# Altium project datapool_8810.PrjPcb
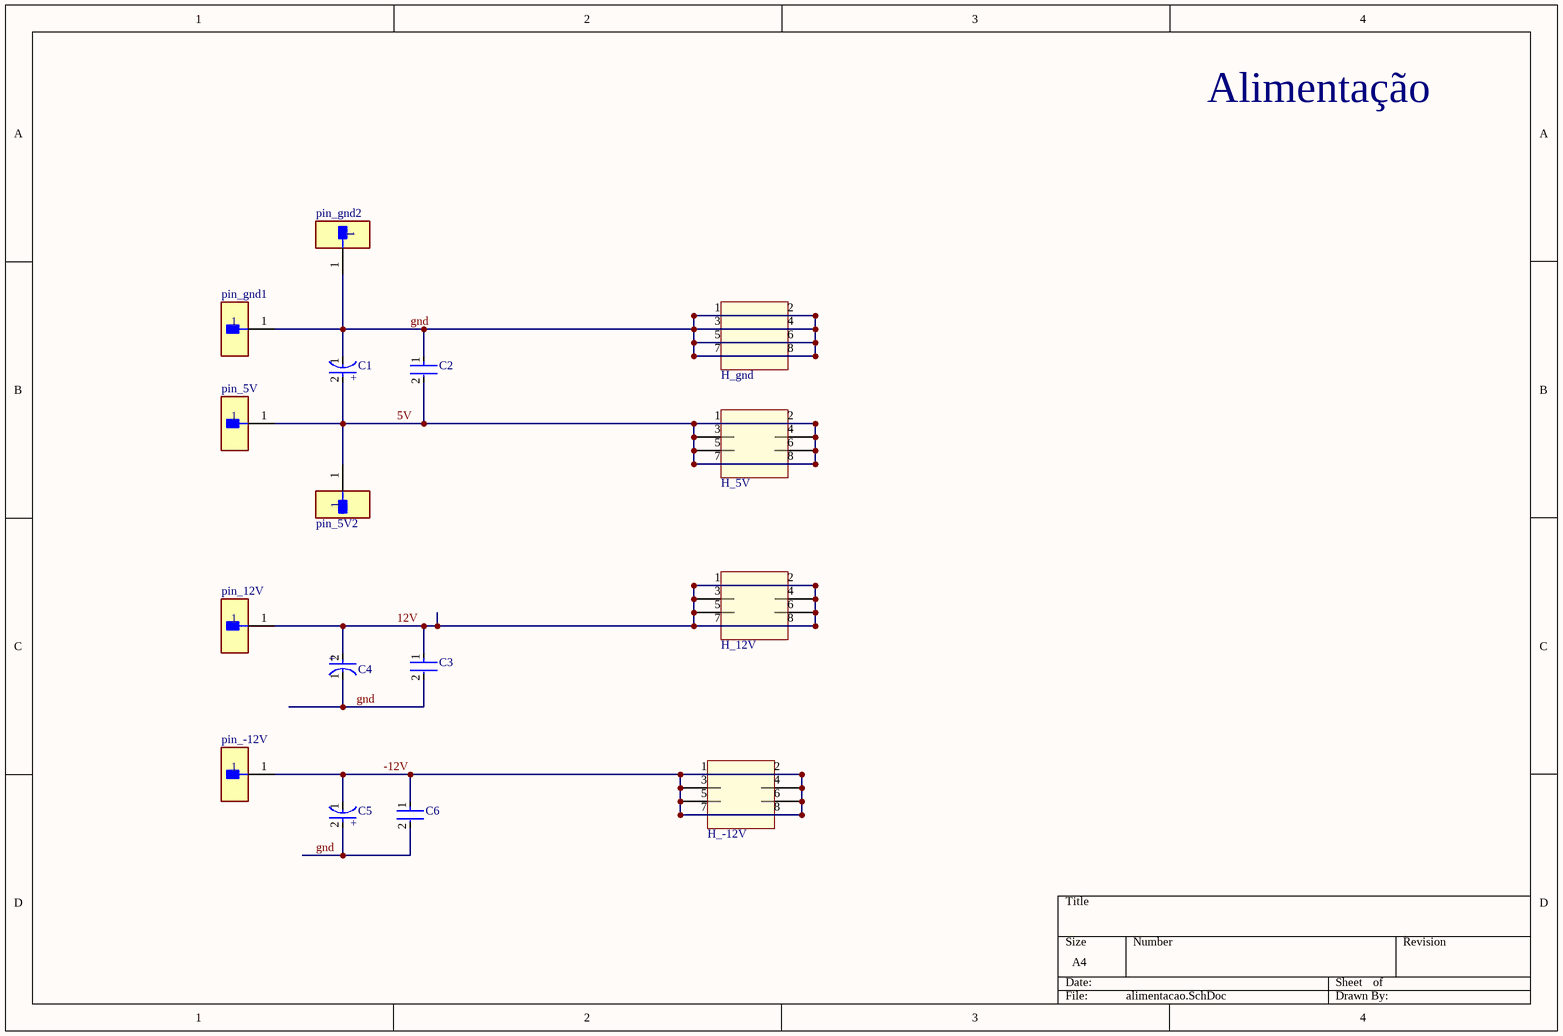
[diagram p0: alimentacao.SchDoc]
4 sheets, 138 parts. Net scope: global (net labels, ports and power ports of the same name join across sheets).
Board file: 8810.PcbDoc
Sheets:
  alimentacao.SchDoc
  leds.SchDoc
  chaves.SchDoc
  clock.SchDoc

## Sheet alimentacao.SchDoc
size A4; SheetNumber: 1; SheetTotal: 7

### Parts
C1  EEU-FM1H101BJ  [FP-FM8-MFG]  (value not drawn)
C2  RCER71H335K3K1H03B  [FP-RCE3M1-MFG]  (value not drawn)
C3  RCER71H335K3K1H03B  [FP-RCE3M1-MFG]  (value not drawn)
C4  EEU-FM1H101BJ  [FP-FM8-MFG]  (value not drawn)
C5  EEU-FM1H101BJ  [FP-FM8-MFG]  (value not drawn)
C6  RCER71H335K3K1H03B  [FP-RCE3M1-MFG]  (value not drawn)
H_5V  header 2x4  [header 2x4]  (value not drawn)
H_12V  header 2x4  [header 2x4]  (value not drawn)
H_-12V  header 2x4  [header 2x4]  (value not drawn)
H_gnd  header 2x4  [header 2x4]  (value not drawn)
pin_5V  TSW-101-07-L-S  [FP-TSW-101-07-L-S-MFG]  (value not drawn)
pin_5V2  TSW-101-07-L-S  [FP-TSW-101-07-L-S-MFG]  (value not drawn)
pin_12V  TSW-101-07-L-S  [FP-TSW-101-07-L-S-MFG]  (value not drawn)
pin_-12V  TSW-101-07-L-S  [FP-TSW-101-07-L-S-MFG]  (value not drawn)
pin_gnd1  TSW-101-07-L-S  [FP-TSW-101-07-L-S-MFG]  (value not drawn)
pin_gnd2  TSW-101-07-L-S  [FP-TSW-101-07-L-S-MFG]  (value not drawn)

### Nets
5V: C1.2(A) C2.2 H_5V.1 H_5V.2 H_5V.3 H_5V.4 H_5V.5 H_5V.6 H_5V.7 H_5V.8 pin_5V.1 pin_5V2.1
12V: C3.1 C4.2(A) H_12V.1 H_12V.2 H_12V.3 H_12V.4 H_12V.5 H_12V.6 H_12V.7 H_12V.8 pin_12V.1
-12V: C5.1(C) C6.1 H_-12V.1 H_-12V.2 H_-12V.3 H_-12V.4 H_-12V.5 H_-12V.6 H_-12V.7 H_-12V.8 pin_-12V.1
gnd: C1.1(C) C2.1 C3.2 C4.1(C) C5.2(A) C6.2 H_gnd.1 H_gnd.2 H_gnd.3 H_gnd.4 H_gnd.5 H_gnd.6 H_gnd.7 H_gnd.8 pin_gnd1.1 pin_gnd2.1

### Notes on the sheet
- Alimentação
- (in symbol CMP-05427-000021-1) +

### Library data of the parts
C1 C4 C5 = CMP-05427-000021-1: CAP ALUM 100UF 20% 50V RADIAL; Polarity: Polar; Impedance: 61mR; Ripple Current: 870mA; Life (Hours): 3000Hour; Dissipation Factor: 0.1%; Packaging: Ammo Pack; Voltage Rating (DC): 50V; Diameter: 8mm; Radiation Hardening: No; Max Operating Temperature: 105°C; Length: 11.5mm; Tolerance: 20%; Termination: Radial; Features: General Purpose; Case/Package: Radial; Voltage Rating: 50V; Min Operating Temperature: -40°C; Height - Seated (Max): 0.512inch; Mount: Through Hole; Series: FM; Height: 11.5mm; Capacitance: 100uF; ESR (Equivalent Series Resistance): 61mR; Lead Free: Lead Free; Lead Pitch: 0.197inch; Package Quantity: 1000
C2 C3 C6 = CMP-06035-028451-1: Cap Ceramic 3.3uF 50V X7R ±10% Radial 5mm +125°C Automotive Ammo Pack; Lead Diameter: 0.5mm; Lead/Base Style: Formed Leads; Height: 5mm; Ratings: AEC-Q200; Capacitance: 3.3uF; Package Quantity: 500; Length: 0.217inch; Min Operating Temperature: -55°C; Voltage Rating (DC): 50V; Dielectric: X7R; Case/Package: Radial; Height - Seated (Max): 0.197inch; Termination: Radial; Mount: Through Hole; Max Operating Temperature: 125°C; Width: 0.157inch; Voltage Rating: 50V; Packaging: Bulk; Resistor Type: Ceramic; Tolerance: 10%; Lead Pitch: 0.197inch
H_5V H_12V H_-12V H_gnd = header 2x4: header male 2x4; pin to pad: 1>C1 2>C2 3>C3 4>C4 5>C5 6>C6 7>C7 8>C8; Parameter 1: header 2x4
pin_5V pin_5V2 pin_12V pin_-12V pin_gnd1 pin_gnd2 = CMP-02766-001775-1: CONN HEADER VERT 1POS; Gender: Male; Number of Contacts: 1; Max Current Rating: 7.6A; Max Voltage Rating (AC): 550V; RoHS Compliant: Yes; Contact Finish - Mating: GOLD; Length: 2.54mm; Series: TSW; Insulation Material: PBT; Reach SVHC Compliant: Yes; Radiation Hardening: No; Contact Plating: Gold; Termination: Solder; Contact Type: Male Pin; Orientation: Straight; Number of Rows: 1; Depth: 2.54mm; Housing Material: Polyester; Lead Free: Lead Free; Fastening Type: Pull; Flammability Rating: UL94 V-0; Mount: Through Hole; Housing Color: Black; Contact Shape: Square; Min Operating Temperature: -55°C; Connector Type: Header; Contact Mating Length: 0.23inch; Width: 2.54mm; Packaging: Bulk; Contact Material: Bronze; Max Operating Temperature: 125°C; Number of Positions: 1; Color: Black; Insulation Color: Black

## Sheet leds.SchDoc
size A3 portrait; SheetNumber: 3; SheetTotal: 7
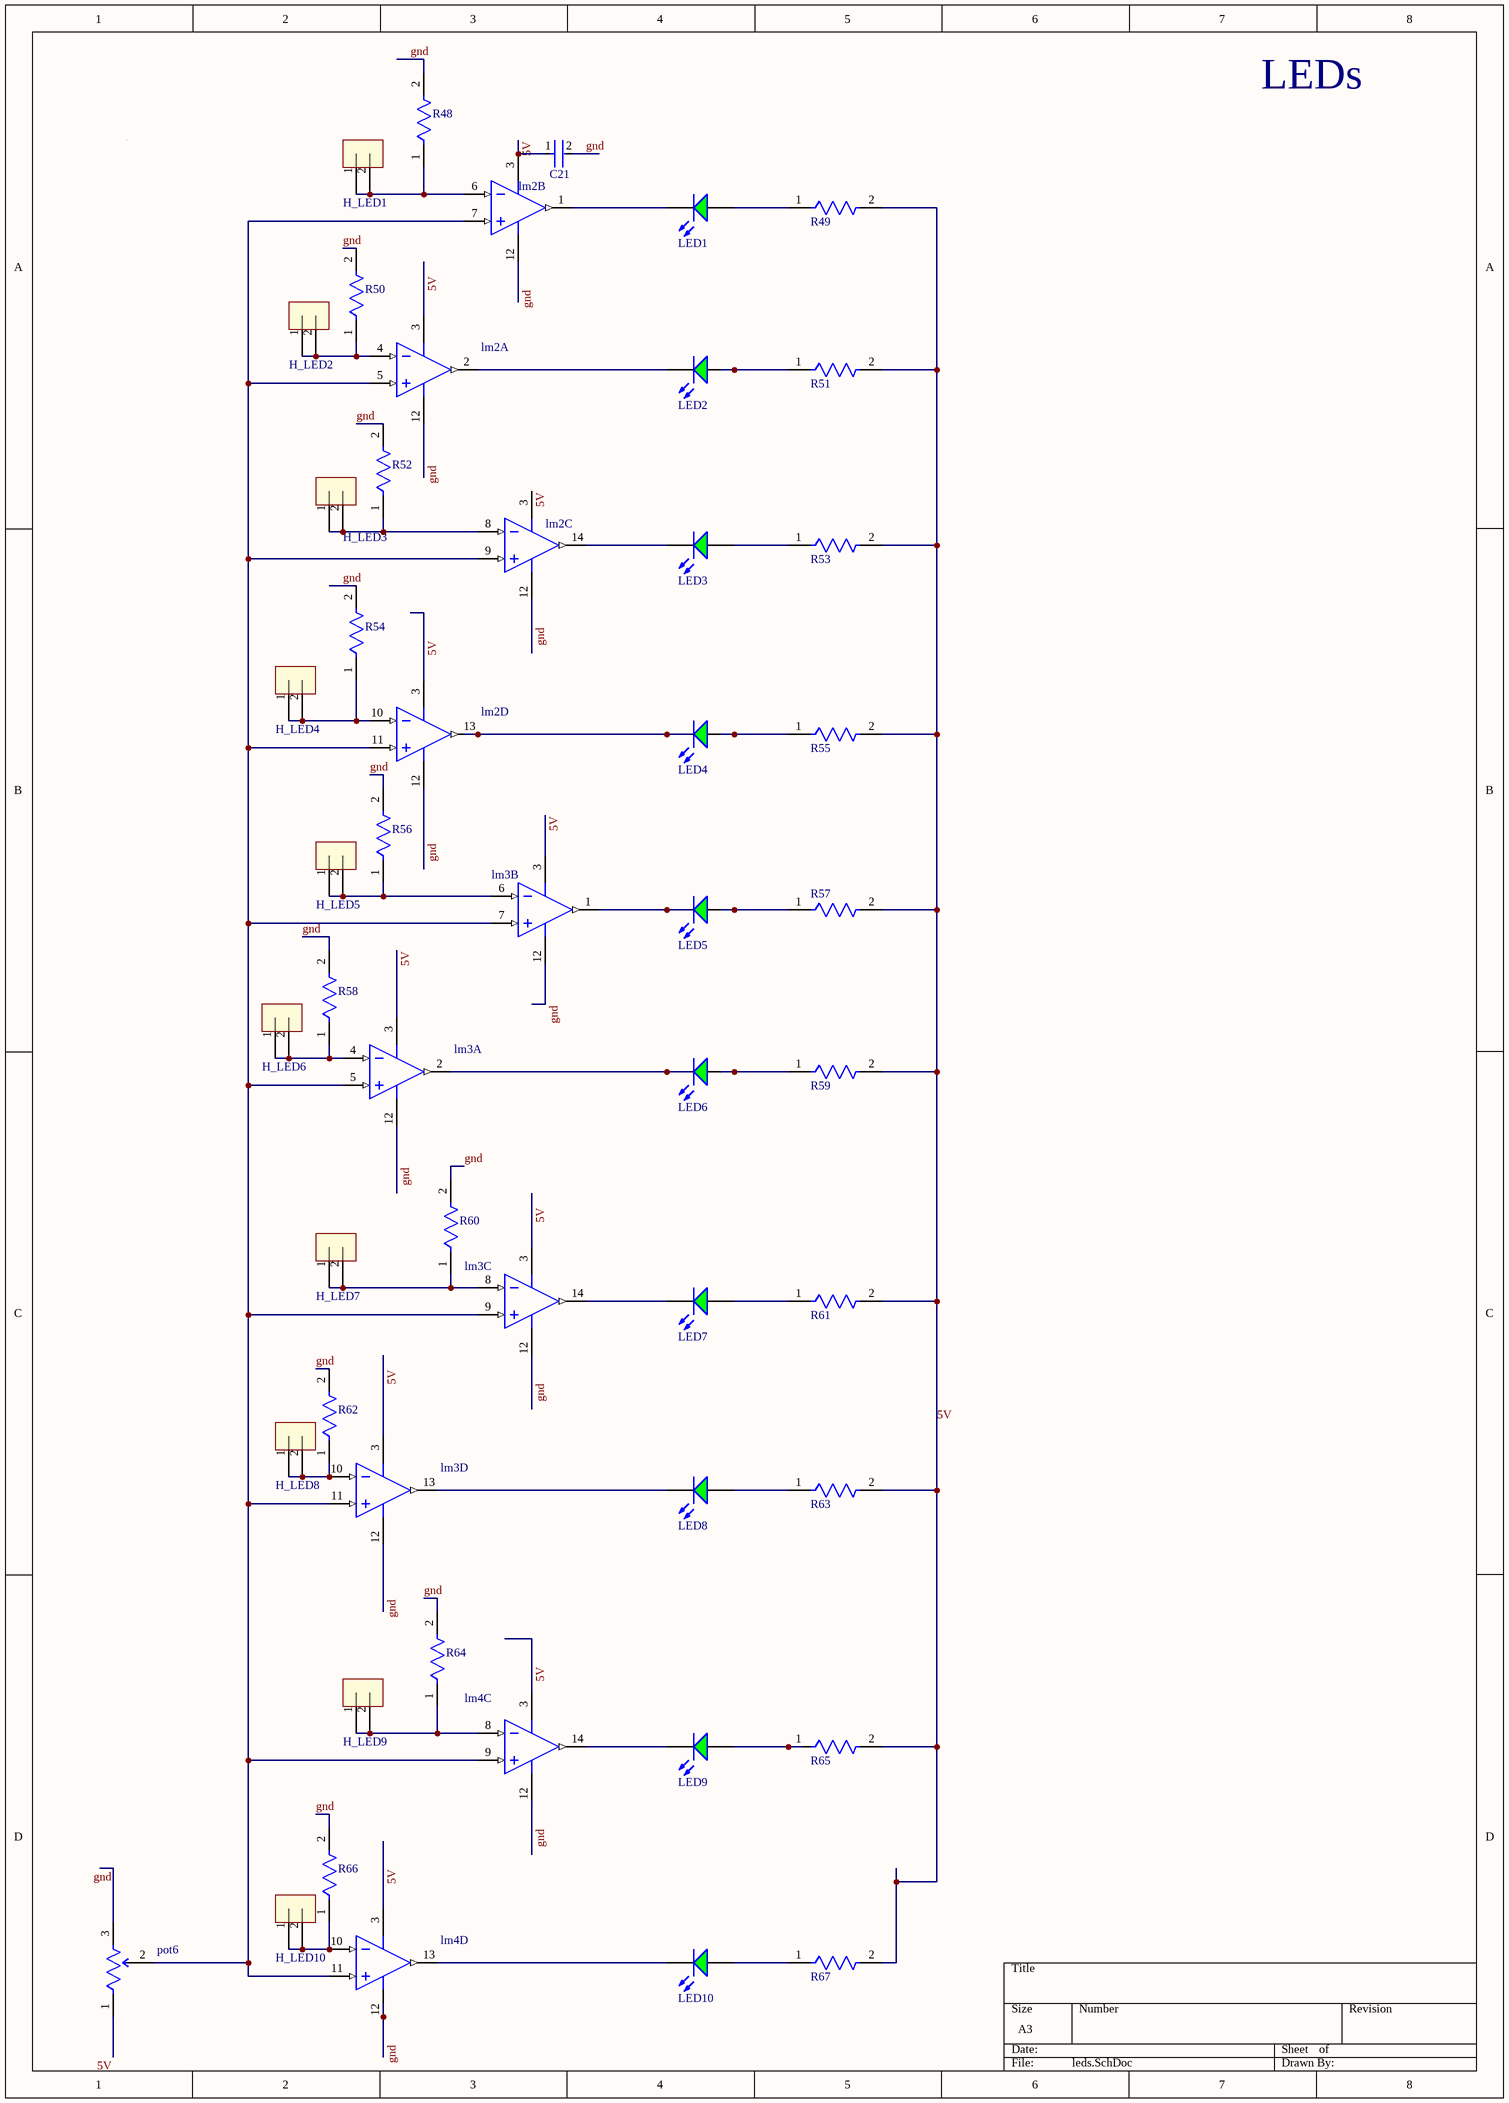
[diagram p1: leds.SchDoc]

### Parts
C21  RCER71H335K3K1H03B  [FP-RCE3M1-MFG]  (value not drawn)
H_LED1  header 2x1  [header 2x1]  (value not drawn)
H_LED2  header 2x1  [header 2x1]  (value not drawn)
H_LED3  header 2x1  [header 2x1]  (value not drawn)
H_LED4  header 2x1  [header 2x1]  (value not drawn)
H_LED5  header 2x1  [header 2x1]  (value not drawn)
H_LED6  header 2x1  [header 2x1]  (value not drawn)
H_LED7  header 2x1  [header 2x1]  (value not drawn)
H_LED8  header 2x1  [header 2x1]  (value not drawn)
H_LED9  header 2x1  [header 2x1]  (value not drawn)
H_LED10  header 2x1  [header 2x1]  (value not drawn)
LED1  WP7113SGD  [KING-WP7113SGD_V]  (value not drawn)
LED2  WP7113SGD  [KING-WP7113SGD_V]  (value not drawn)
LED3  WP7113SGD  [KING-WP7113SGD_V]  (value not drawn)
LED4  WP7113SGD  [KING-WP7113SGD_V]  (value not drawn)
LED5  WP7113SGD  [KING-WP7113SGD_V]  (value not drawn)
LED6  WP7113SGD  [KING-WP7113SGD_V]  (value not drawn)
LED7  WP7113SGD  [KING-WP7113SGD_V]  (value not drawn)
LED8  WP7113SGD  [KING-WP7113SGD_V]  (value not drawn)
LED9  WP7113SGD  [KING-WP7113SGD_V]  (value not drawn)
LED10  WP7113SGD  [KING-WP7113SGD_V]  (value not drawn)
lm2  LM339J  [J0014A]  (value not drawn)  (parts A,B,C,D of 4)
lm3  LM339J  [J0014A]  (value not drawn)  (parts A,B,C,D of 4)
lm4  LM339J  [J0014A]  (value not drawn)  (parts C,D of 4)
pot6  3296W-1-501LF  [FP-3296W-MFG]  (value not drawn)
R48  MRS16000C2002FCT00  [FP-MRS1600-MFG]  (value not drawn)
R49  MRS16000C2002FCT00  [FP-MRS1600-MFG]  (value not drawn)
R50  MRS16000C2002FCT00  [FP-MRS1600-MFG]  (value not drawn)
R51  MRS16000C2002FCT00  [FP-MRS1600-MFG]  (value not drawn)
R52  MRS16000C2002FCT00  [FP-MRS1600-MFG]  (value not drawn)
R53  MRS16000C2002FCT00  [FP-MRS1600-MFG]  (value not drawn)
R54  MRS16000C2002FCT00  [FP-MRS1600-MFG]  (value not drawn)
R55  MRS16000C2002FCT00  [FP-MRS1600-MFG]  (value not drawn)
R56  MRS16000C2002FCT00  [FP-MRS1600-MFG]  (value not drawn)
R57  MRS16000C2002FCT00  [FP-MRS1600-MFG]  (value not drawn)
R58  MRS16000C2002FCT00  [FP-MRS1600-MFG]  (value not drawn)
R59  MRS16000C2002FCT00  [FP-MRS1600-MFG]  (value not drawn)
R60  MRS16000C2002FCT00  [FP-MRS1600-MFG]  (value not drawn)
R61  MRS16000C2002FCT00  [FP-MRS1600-MFG]  (value not drawn)
R62  MRS16000C2002FCT00  [FP-MRS1600-MFG]  (value not drawn)
R63  MRS16000C2002FCT00  [FP-MRS1600-MFG]  (value not drawn)
R64  MRS16000C2002FCT00  [FP-MRS1600-MFG]  (value not drawn)
R65  MRS16000C2002FCT00  [FP-MRS1600-MFG]  (value not drawn)
R66  MRS16000C2002FCT00  [FP-MRS1600-MFG]  (value not drawn)
R67  MRS16000C2002FCT00  [FP-MRS1600-MFG]  (value not drawn)

### Nets
5V: C21.1 lm2.3(V+) lm3.3(V+) lm4.3(V+) pot6.1(CCW) R49.2 R51.2 R53.2 R55.2 R57.2 R59.2 R61.2 R63.2 R65.2 R67.2
gnd: C21.2 lm2.12(GND) lm3.12(GND) lm4.12(GND) pot6.3(CW) R48.2 R50.2 R52.2 R54.2 R56.2 R58.2 R60.2 R62.2 R64.2 R66.2
NetH_LED1_1: H_LED1.1 H_LED1.2 lm2.6(IN2-) R48.1
NetH_LED2_1: H_LED2.1 H_LED2.2 lm2.4(IN1-) R50.1
NetH_LED3_1: H_LED3.1 H_LED3.2 lm2.8(IN3-) R52.1
NetH_LED4_1: H_LED4.1 H_LED4.2 lm2.10(IN4-) R54.1
NetH_LED5_1: H_LED5.1 H_LED5.2 lm3.6(IN2-) R56.1
NetH_LED6_1: H_LED6.1 H_LED6.2 lm3.4(IN1-) R58.1
NetH_LED7_1: H_LED7.1 H_LED7.2 lm3.8(IN3-) R60.1
NetH_LED8_1: H_LED8.1 H_LED8.2 lm3.10(IN4-) R62.1
NetH_LED9_1: H_LED9.1 H_LED9.2 lm4.8(IN3-) R64.1
NetH_LED10_1: H_LED10.1 H_LED10.2 lm4.10(IN4-) R66.1
NetLED1_1: LED1.1(A) R49.1
NetLED1_2: LED1.2(K) lm2.1(OUT2)
NetLED2_1: LED2.1(A) R51.1
NetLED2_2: LED2.2(K) lm2.2(OUT1)
NetLED3_1: LED3.1(A) R53.1
NetLED3_2: LED3.2(K) lm2.14(OUT3)
NetLED4_1: LED4.1(A) R55.1
NetLED4_2: LED4.2(K) lm2.13(OUT4)
NetLED5_1: LED5.1(A) R57.1
NetLED5_2: LED5.2(K) lm3.1(OUT2)
NetLED6_1: LED6.1(A) R59.1
NetLED6_2: LED6.2(K) lm3.2(OUT1)
NetLED7_1: LED7.1(A) R61.1
NetLED7_2: LED7.2(K) lm3.14(OUT3)
NetLED8_1: LED8.1(A) R63.1
NetLED8_2: LED8.2(K) lm3.13(OUT4)
NetLED9_1: LED9.1(A) R65.1
NetLED9_2: LED9.2(K) lm4.14(OUT3)
NetLED10_1: LED10.1(A) R67.1
NetLED10_2: LED10.2(K) lm4.13(OUT4)
Netlm2_5: lm2.5(IN1+) lm2.7(IN2+) lm2.9(IN3+) lm2.11(IN4+) lm3.5(IN1+) lm3.7(IN2+) lm3.9(IN3+) lm3.11(IN4+) lm4.9(IN3+) lm4.11(IN4+) pot6.2(WIPER)

### Notes on the sheet
- LEDs

### Library data of the parts
C21 = CMP-06035-028451-1: as C2 on sheet alimentacao; Height: 5mm; Ratings: AEC-Q200; Capacitance: 3.3uF; Package Quantity: 500; Length: 0.217inch; Min Operating Temperature: -55°C; Voltage Rating (DC): 50V; Dielectric: X7R; Case/Package: Radial; Height - Seated (Max): 0.197inch; Termination: Radial; Mount: Through Hole; Max Operating Temperature: 125°C; Width: 0.157inch; Voltage Rating: 50V; Packaging: Bulk; Resistor Type: Ceramic; Tolerance: 10%; Lead Pitch: 0.197inch
H_LED1-H_LED10 = Heade 1x2: header male 2 pin; pin to pad: 1>C1 2>C2; Parameter 1: H2x1; Parameter 2: *
LED1-LED10 = CMP-2100-03698-1: LED Green, 62.5 mW, 25 mA, -40 to 85 degC, 2-Pin THD, RoHS, Bulk; Manufacturer: Kingbright; Viewing Angle: 30degrees; Lens Style: Tinted; Test Current: 20mA; Forward Voltage: 2.2V; Wavelength: 568nm; Luminous Intensity: 40mcd; Package Reference: WP7113SGD; Colour: Green; Lead Free: LeadFree; Packaging: Bulk; RoHSCompliant: true; Package Quantity: 1000; Illumination Colour: Green; Case/Package: Radial; Datasheet URL: http://www.kingbrightusa.com/images/catalog/SPEC/WP7113SGD.pdf; Dominant Wavelength: 568nm; Datasheet Version: Rev. 6B, 01/2015; Package Description: 2-Pin Through Hole Device, Dia 5.9 mm, Body Length 8.6 mm; Height: 8.6mm
lm2-lm4 = CMP-0060-00012-3: Low Power Low Offset Voltage Quad Comparator, 14-pin CerDIP; Manufacturer: Texas Instruments; PowerWise: N; PackageTopMarking: NSUZXYYTT*LM339J; PackageDescription: Cerdip, .400 x .310in Body, 14 Lead, .300in Centers, .100in Pitch; ComponentLink1Description: Datasheet URL; PinCount: 14; PackageReference: J0014A; ComponentLink1URL: http://www.ti.com/general/docs/lit/getliterature.tsp?genericPartNumber=LM339-N&fileType=pdf; CompType: Comparator; RoHS: N
pot6 = CMP-07234-000046-1: TRIMMER 500 OHM 0.5W PC PIN TOP; Resistance: 500R; Temperature Coefficient: 100ppm/°C; Resistance Tolerance: 10%; Number of Turns: 25; Max Power Dissipation: 500mW; Packaging: Rail/Tube; Color: Blue; Technology: CERMET; Max Operating Temperature: 125°C; RoHS Compliant: Yes; Radiation Hardening: No; Series: 3296; Military Standard: Not; Width: 9.53mm; Weight: 0.03oz; Length: 9.53mm; Package Quantity: 50; Height: 0.395inch; Min Operating Temperature: -55°C; Lead Free: Lead Free; Mount: Through Hole; Depth: 4.83mm; Termination: Pin; Taper: Linear; Contact Plating: Tin; Resistor Type: Cermet; Tolerance: 10%; REACH SVHC: No SVHC; Power Rating: 500mW
R48-R67 = CMP-02408-000019-1: RES 20K OHM 0.4W 1% AXIAL; Max Power Dissipation: 400mW; Temperature Coefficient: 50ppm/°C; Resistance: 20kR; Technology: THIN FILM; Max Operating Temperature: 155°C; Number of Terminations: 2; RoHS Compliant: Yes; Packaging: Tape and Reel; Radiation Hardening: No; Contact Plating: Tin; Military Standard: Not; Construction: Cylindrical; Diameter: 1.6mm; Tolerance: 1%; Mount: Through Hole; Power Rating: 400mW; Case/Package: Conformal; Termination: Axial; Length: 3.6mm; Min Operating Temperature: -55°C; Resistor Type: Metal Film; Series: MRS16

## Sheet chaves.SchDoc
size A3 portrait; SheetNumber: 4; SheetTotal: 7
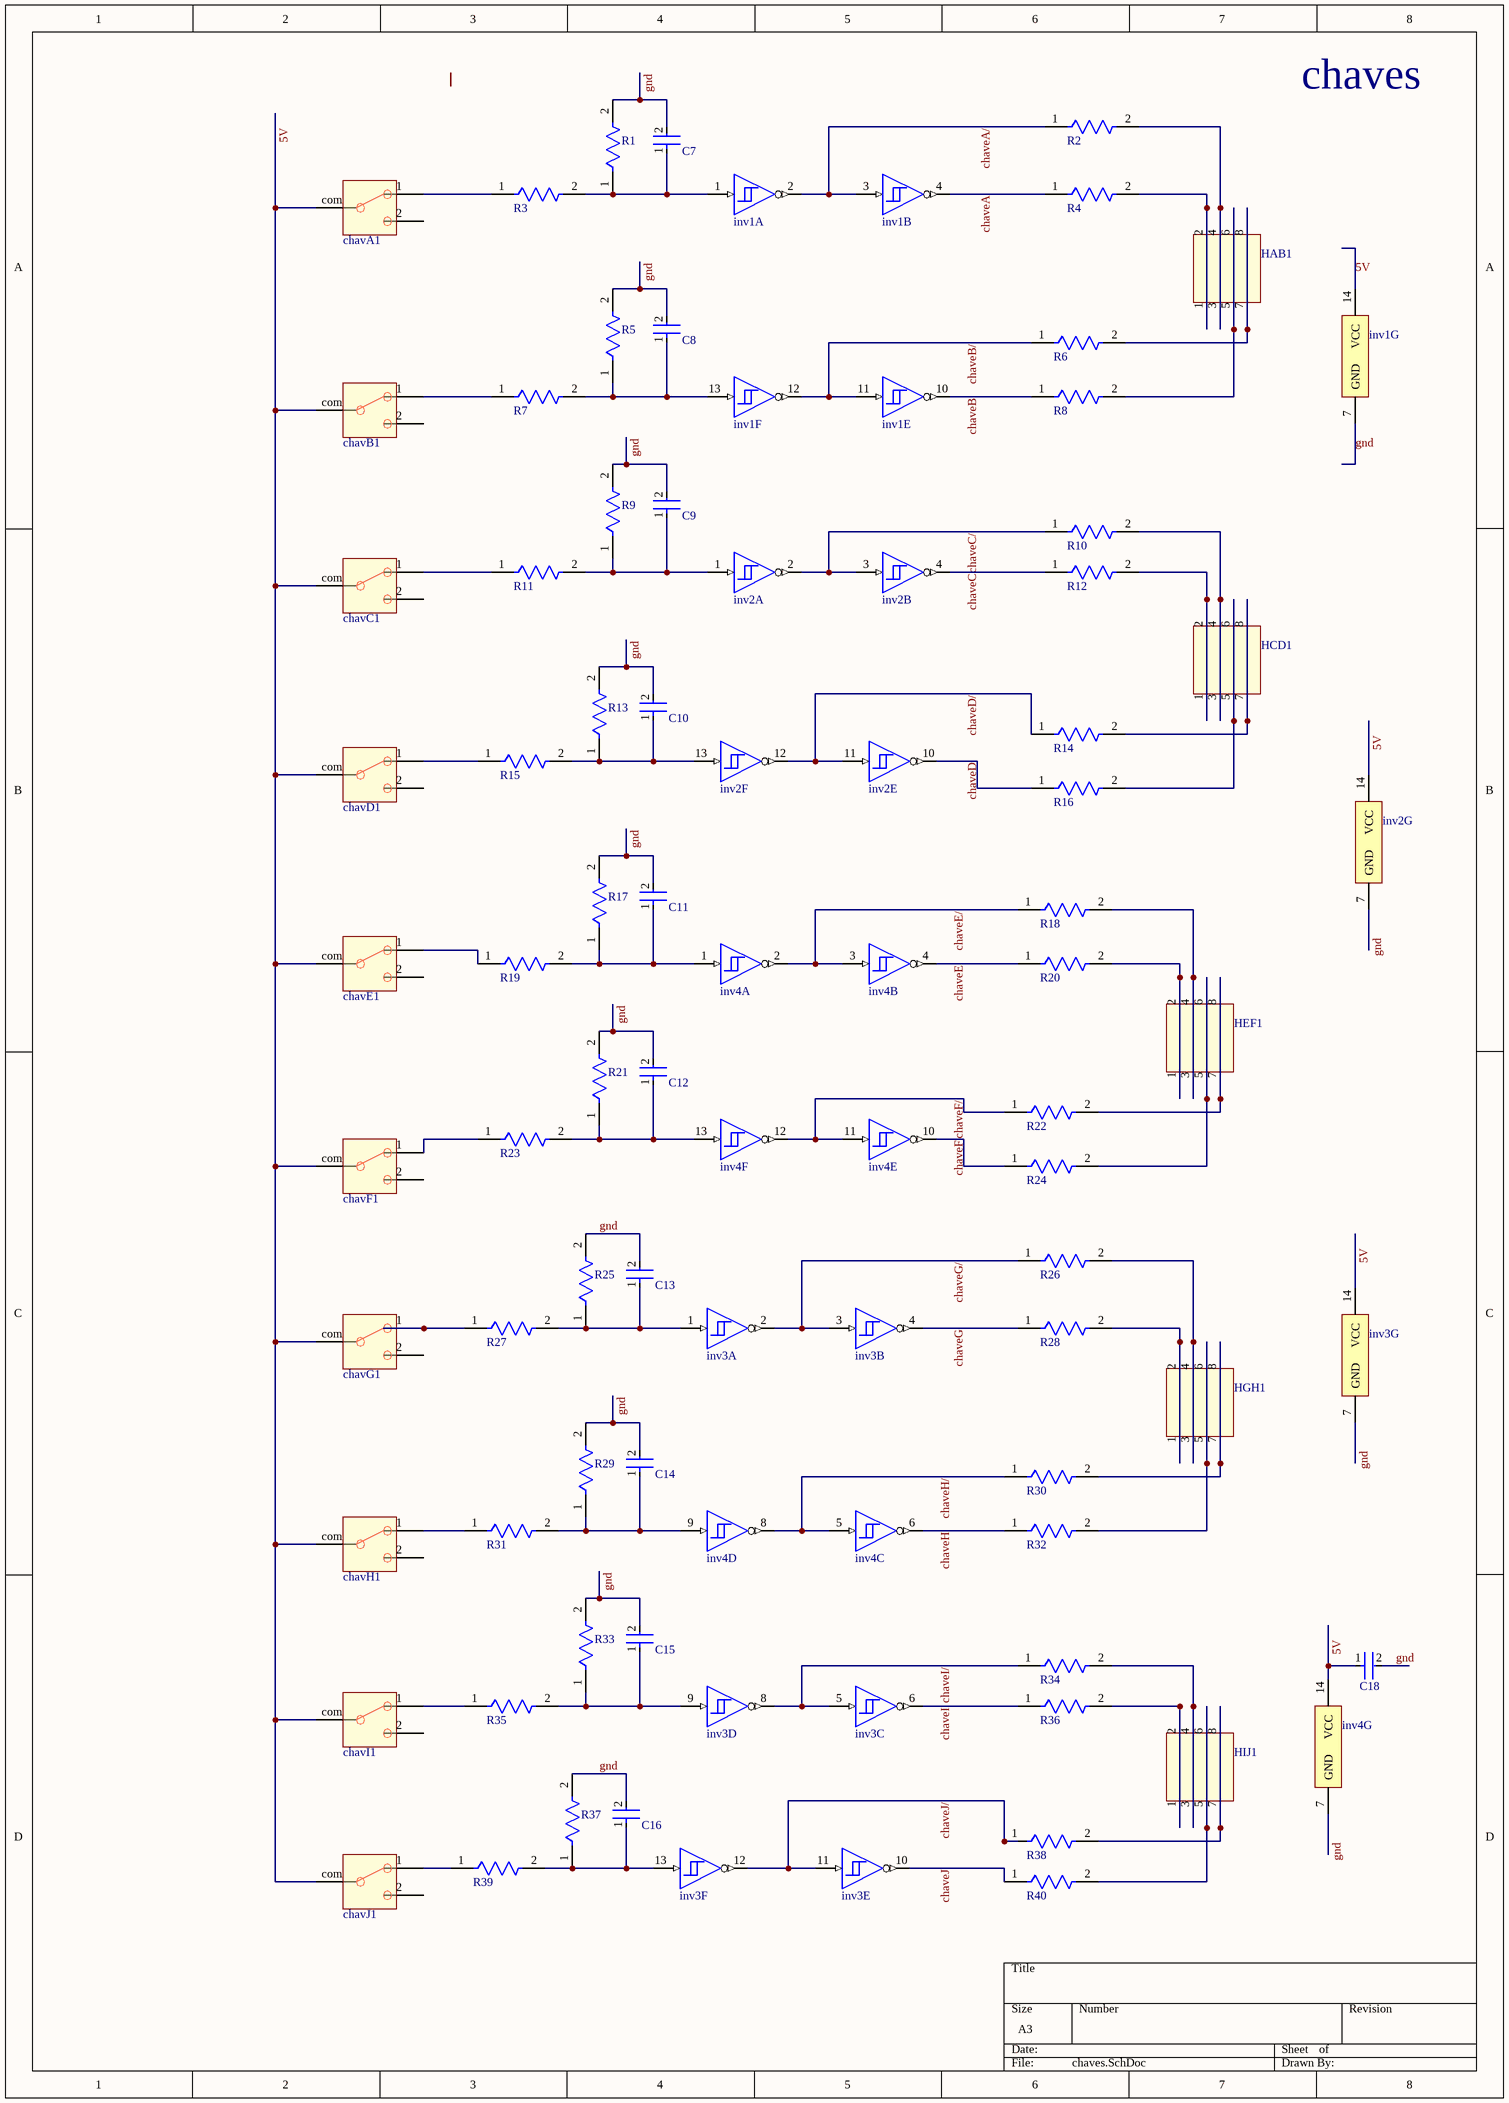
[diagram p2: chaves.SchDoc]

### Parts
C7  RCER71H335K3K1H03B  [FP-RCE3M1-MFG]  (value not drawn)
C8  RCER71H335K3K1H03B  [FP-RCE3M1-MFG]  (value not drawn)
C9  RCER71H335K3K1H03B  [FP-RCE3M1-MFG]  (value not drawn)
C10  RCER71H335K3K1H03B  [FP-RCE3M1-MFG]  (value not drawn)
C11  RCER71H335K3K1H03B  [FP-RCE3M1-MFG]  (value not drawn)
C12  RCER71H335K3K1H03B  [FP-RCE3M1-MFG]  (value not drawn)
C13  RCER71H335K3K1H03B  [FP-RCE3M1-MFG]  (value not drawn)
C14  RCER71H335K3K1H03B  [FP-RCE3M1-MFG]  (value not drawn)
C15  RCER71H335K3K1H03B  [FP-RCE3M1-MFG]  (value not drawn)
C16  RCER71H335K3K1H03B  [FP-RCE3M1-MFG]  (value not drawn)
C18  RCER71H335K3K1H03B  [FP-RCE3M1-MFG]  (value not drawn)
chavA1  chave MTS-102  [MTS-102]  (value not drawn)
chavB1  chave MTS-102  [MTS-102]  (value not drawn)
chavC1  chave MTS-102  [MTS-102]  (value not drawn)
chavD1  chave MTS-102  [MTS-102]  (value not drawn)
chavE1  chave MTS-102  [MTS-102]  (value not drawn)
chavF1  chave MTS-102  [MTS-102]  (value not drawn)
chavG1  chave MTS-102  [MTS-102]  (value not drawn)
chavH1  chave MTS-102  [MTS-102]  (value not drawn)
chavI1  chave MTS-102  [MTS-102]  (value not drawn)
chavJ1  chave MTS-102  [MTS-102]  (value not drawn)
HAB1  header 2x4  [header 2x4]  (value not drawn)
HCD1  header 2x4  [header 2x4]  (value not drawn)
HEF1  header 2x4  [header 2x4]  (value not drawn)
HGH1  header 2x4  [header 2x4]  (value not drawn)
HIJ1  header 2x4  [header 2x4]  (value not drawn)
inv1  SN74HC14N  [N0014A]  (value not drawn)  (parts A,B,E,F,G of 7)
inv2  SN74HC14N  [N0014A]  (value not drawn)  (parts A,B,E,F,G of 7)
inv3  SN74HC14N  [N0014A]  (value not drawn)  (parts A,B,C,D,E,F,G of 7)
inv4  SN74HC14N  [N0014A]  (value not drawn)  (parts A,B,C,D,E,F,G of 7)
R1  MRS16000C2002FCT00  [FP-MRS1600-MFG]  (value not drawn)
R2  MRS16000C2002FCT00  [FP-MRS1600-MFG]  (value not drawn)
R3  MRS16000C2002FCT00  [FP-MRS1600-MFG]  (value not drawn)
R4  MRS16000C2002FCT00  [FP-MRS1600-MFG]  (value not drawn)
R5  MRS16000C2002FCT00  [FP-MRS1600-MFG]  (value not drawn)
R6  MRS16000C2002FCT00  [FP-MRS1600-MFG]  (value not drawn)
R7  MRS16000C2002FCT00  [FP-MRS1600-MFG]  (value not drawn)
R8  MRS16000C2002FCT00  [FP-MRS1600-MFG]  (value not drawn)
R9  MRS16000C2002FCT00  [FP-MRS1600-MFG]  (value not drawn)
R10  MRS16000C2002FCT00  [FP-MRS1600-MFG]  (value not drawn)
R11  MRS16000C2002FCT00  [FP-MRS1600-MFG]  (value not drawn)
R12  MRS16000C2002FCT00  [FP-MRS1600-MFG]  (value not drawn)
R13  MRS16000C2002FCT00  [FP-MRS1600-MFG]  (value not drawn)
R14  MRS16000C2002FCT00  [FP-MRS1600-MFG]  (value not drawn)
R15  MRS16000C2002FCT00  [FP-MRS1600-MFG]  (value not drawn)
R16  MRS16000C2002FCT00  [FP-MRS1600-MFG]  (value not drawn)
R17  MRS16000C2002FCT00  [FP-MRS1600-MFG]  (value not drawn)
R18  MRS16000C2002FCT00  [FP-MRS1600-MFG]  (value not drawn)
R19  MRS16000C2002FCT00  [FP-MRS1600-MFG]  (value not drawn)
R20  MRS16000C2002FCT00  [FP-MRS1600-MFG]  (value not drawn)
R21  MRS16000C2002FCT00  [FP-MRS1600-MFG]  (value not drawn)
R22  MRS16000C2002FCT00  [FP-MRS1600-MFG]  (value not drawn)
R23  MRS16000C2002FCT00  [FP-MRS1600-MFG]  (value not drawn)
R24  MRS16000C2002FCT00  [FP-MRS1600-MFG]  (value not drawn)
R25  MRS16000C2002FCT00  [FP-MRS1600-MFG]  (value not drawn)
R26  MRS16000C2002FCT00  [FP-MRS1600-MFG]  (value not drawn)
R27  MRS16000C2002FCT00  [FP-MRS1600-MFG]  (value not drawn)
R28  MRS16000C2002FCT00  [FP-MRS1600-MFG]  (value not drawn)
R29  MRS16000C2002FCT00  [FP-MRS1600-MFG]  (value not drawn)
R30  MRS16000C2002FCT00  [FP-MRS1600-MFG]  (value not drawn)
R31  MRS16000C2002FCT00  [FP-MRS1600-MFG]  (value not drawn)
R32  MRS16000C2002FCT00  [FP-MRS1600-MFG]  (value not drawn)
R33  MRS16000C2002FCT00  [FP-MRS1600-MFG]  (value not drawn)
R34  MRS16000C2002FCT00  [FP-MRS1600-MFG]  (value not drawn)
R35  MRS16000C2002FCT00  [FP-MRS1600-MFG]  (value not drawn)
R36  MRS16000C2002FCT00  [FP-MRS1600-MFG]  (value not drawn)
R37  MRS16000C2002FCT00  [FP-MRS1600-MFG]  (value not drawn)
R38  MRS16000C2002FCT00  [FP-MRS1600-MFG]  (value not drawn)
R39  MRS16000C2002FCT00  [FP-MRS1600-MFG]  (value not drawn)
R40  MRS16000C2002FCT00  [FP-MRS1600-MFG]  (value not drawn)

### Nets
5V: C18.1 chavA1.com chavB1.com chavC1.com chavD1.com chavE1.com chavF1.com chavG1.com chavH1.com chavI1.com chavJ1.com inv1.14(VCC) inv2.14(VCC) inv3.14(VCC) inv4.14(VCC)
chaveA: inv1.4(~{2Y}) R4.1
chaveA/: inv1.2(~{1Y}) inv1.3(2A) R2.1
chaveB: inv1.10(~{5Y}) R8.1
chaveB/: inv1.11(5A) inv1.12(~{6Y}) R6.1
chaveC: inv2.4(~{2Y}) R12.1
chaveC/: inv2.2(~{1Y}) inv2.3(2A) R10.1
chaveD: inv2.10(~{5Y}) R16.1
chaveD/: inv2.11(5A) inv2.12(~{6Y}) R14.1
chaveE: inv4.4(~{2Y}) R20.1
chaveE/: inv4.2(~{1Y}) inv4.3(2A) R18.1
chaveF: inv4.10(~{5Y}) R24.1
chaveF/: inv4.11(5A) inv4.12(~{6Y}) R22.1
chaveG: inv3.4(~{2Y}) R28.1
chaveG/: inv3.2(~{1Y}) inv3.3(2A) R26.1
chaveH: inv4.6(~{3Y}) R32.1
chaveH/: inv4.5(3A) inv4.8(~{4Y}) R30.1
chaveI: inv3.6(~{3Y}) R36.1
chaveI/: inv3.5(3A) inv3.8(~{4Y}) R34.1
chaveJ: inv3.10(~{5Y}) R40.1
chaveJ/: inv3.11(5A) inv3.12(~{6Y}) R38.1
gnd: C7.2 C8.2 C9.2 C10.2 C11.2 C12.2 C13.2 C14.2 C15.2 C16.2 C18.2 inv1.7(GND) inv2.7(GND) inv3.7(GND) inv4.7(GND) R1.2 R5.2 R9.2 R13.2 R17.2 R21.2 R25.2 R29.2 R33.2 R37.2
NetC7_1: C7.1 inv1.1(1A) R1.1 R3.2
NetC8_1: C8.1 inv1.13(6A) R5.1 R7.2
NetC9_1: C9.1 inv2.1(1A) R9.1 R11.2
NetC10_1: C10.1 inv2.13(6A) R13.1 R15.2
NetC11_1: C11.1 inv4.1(1A) R17.1 R19.2
NetC12_1: C12.1 inv4.13(6A) R21.1 R23.2
NetC13_1: C13.1 inv3.1(1A) R25.1 R27.2
NetC14_1: C14.1 inv4.9(4A) R29.1 R31.2
NetC15_1: C15.1 inv3.9(4A) R33.1 R35.2
NetC16_1: C16.1 inv3.13(6A) R37.1 R39.2
NetchavA1_1: chavA1.1 R3.1
NetchavB1_1: chavB1.1 R7.1
NetchavC1_1: chavC1.1 R11.1
NetchavD1_1: chavD1.1 R15.1
NetchavE1_1: chavE1.1 R19.1
NetchavF1_1: chavF1.1 R23.1
NetchavG1_1: chavG1.1 R27.1
NetchavH1_1: chavH1.1 R31.1
NetchavI1_1: chavI1.1 R35.1
NetchavJ1_1: chavJ1.1 R39.1
NetHAB1_1: HAB1.1 HAB1.2 R4.2
NetHAB1_3: HAB1.3 HAB1.4 R2.2
NetHAB1_5: HAB1.5 HAB1.6 R8.2
NetHAB1_7: HAB1.7 HAB1.8 R6.2
NetHCD1_1: HCD1.1 HCD1.2 R12.2
NetHCD1_3: HCD1.3 HCD1.4 R10.2
NetHCD1_5: HCD1.5 HCD1.6 R16.2
NetHCD1_7: HCD1.7 HCD1.8 R14.2
NetHEF1_1: HEF1.1 HEF1.2 R20.2
NetHEF1_3: HEF1.3 HEF1.4 R18.2
NetHEF1_5: HEF1.5 HEF1.6 R24.2
NetHEF1_7: HEF1.7 HEF1.8 R22.2
NetHGH1_1: HGH1.1 HGH1.2 R28.2
NetHGH1_3: HGH1.3 HGH1.4 R26.2
NetHGH1_5: HGH1.5 HGH1.6 R32.2
NetHGH1_7: HGH1.7 HGH1.8 R30.2
NetHIJ1_1: HIJ1.1 HIJ1.2 R36.2
NetHIJ1_3: HIJ1.3 HIJ1.4 R34.2
NetHIJ1_5: HIJ1.5 HIJ1.6 R40.2
NetHIJ1_7: HIJ1.7 HIJ1.8 R38.2

Not connected (* = marked no-connect by the designer): chavA1 2; chavB1 2; chavC1 2; chavD1 2; chavE1 2; chavF1 2; chavG1 2; chavH1 2; chavI1 2; chavJ1 2

### Notes on the sheet
- chaves

### Library data of the parts
C7-C16 C18 = CMP-06035-028451-1: as C2 on sheet alimentacao; Height: 5mm; Ratings: AEC-Q200; Capacitance: 3.3uF; Package Quantity: 500; Length: 0.217inch; Min Operating Temperature: -55°C; Voltage Rating (DC): 50V; Dielectric: X7R; Case/Package: Radial; Height - Seated (Max): 0.197inch; Termination: Radial; Mount: Through Hole; Max Operating Temperature: 125°C; Width: 0.157inch; Voltage Rating: 50V; Packaging: Bulk; Resistor Type: Ceramic; Tolerance: 10%; Lead Pitch: 0.197inch
chavA1 chavB1 chavC1 chavD1 chavE1 chavF1 chavG1 chavH1 chavI1 chavJ1 = MTS-102: chave caso seja usadsada sendo encaixada; pin to pad: 1>C2 2>com com>C3; Parameter 1: MTS-102
HAB1 HCD1 HEF1 HGH1 HIJ1 = header 2x4: header male 2x4; pin to pad: 1>C1 2>C2 3>C3 4>C4 5>C5 6>C6 7>C7 8>C8; Parameter 1: header 2x4
inv1-inv4 = CMP-1615-00889-3: Hex Schmitt-Trigger Inverters, N0014A, TUBE; Manufacturer: Texas Instruments; Input Type: CMOS; Voltage(Nom)(V): 5; VCC(Min)(V): 2; tpd @ Nom Voltage(Max)(ns): 31; Technology Family: HC; VCC(Max)(V): 6; F @ Nom Voltage(Max)(Mhz): 20; Output Drive (IOL/IOH)(Max)(mA): -4/4; Rating: Catalog; Schmitt Trigger: Yes; ICC @ Nom Voltage(Max)(mA): 0.02; PackageReference: N0014A; Code_JEDEC: MS-001; Operating Temperature Range(C): -40 to 85; Generic Part Number: SN74HC14; Bits(#): 6; DatasheetVersion: SCLS085G; Output Type: CMOS
R1-R40 = CMP-02408-000019-1: as R48 on sheet leds; Technology: THIN FILM; Max Operating Temperature: 155°C; Number of Terminations: 2; RoHS Compliant: Yes; Packaging: Tape and Reel; Radiation Hardening: No; Contact Plating: Tin; Military Standard: Not; Construction: Cylindrical; Diameter: 1.6mm; Tolerance: 1%; Mount: Through Hole; Power Rating: 400mW; Case/Package: Conformal; Termination: Axial; Length: 3.6mm; Min Operating Temperature: -55°C; Resistor Type: Metal Film; Series: MRS16

## Sheet clock.SchDoc
size A4; SheetNumber: 5; SheetTotal: 7
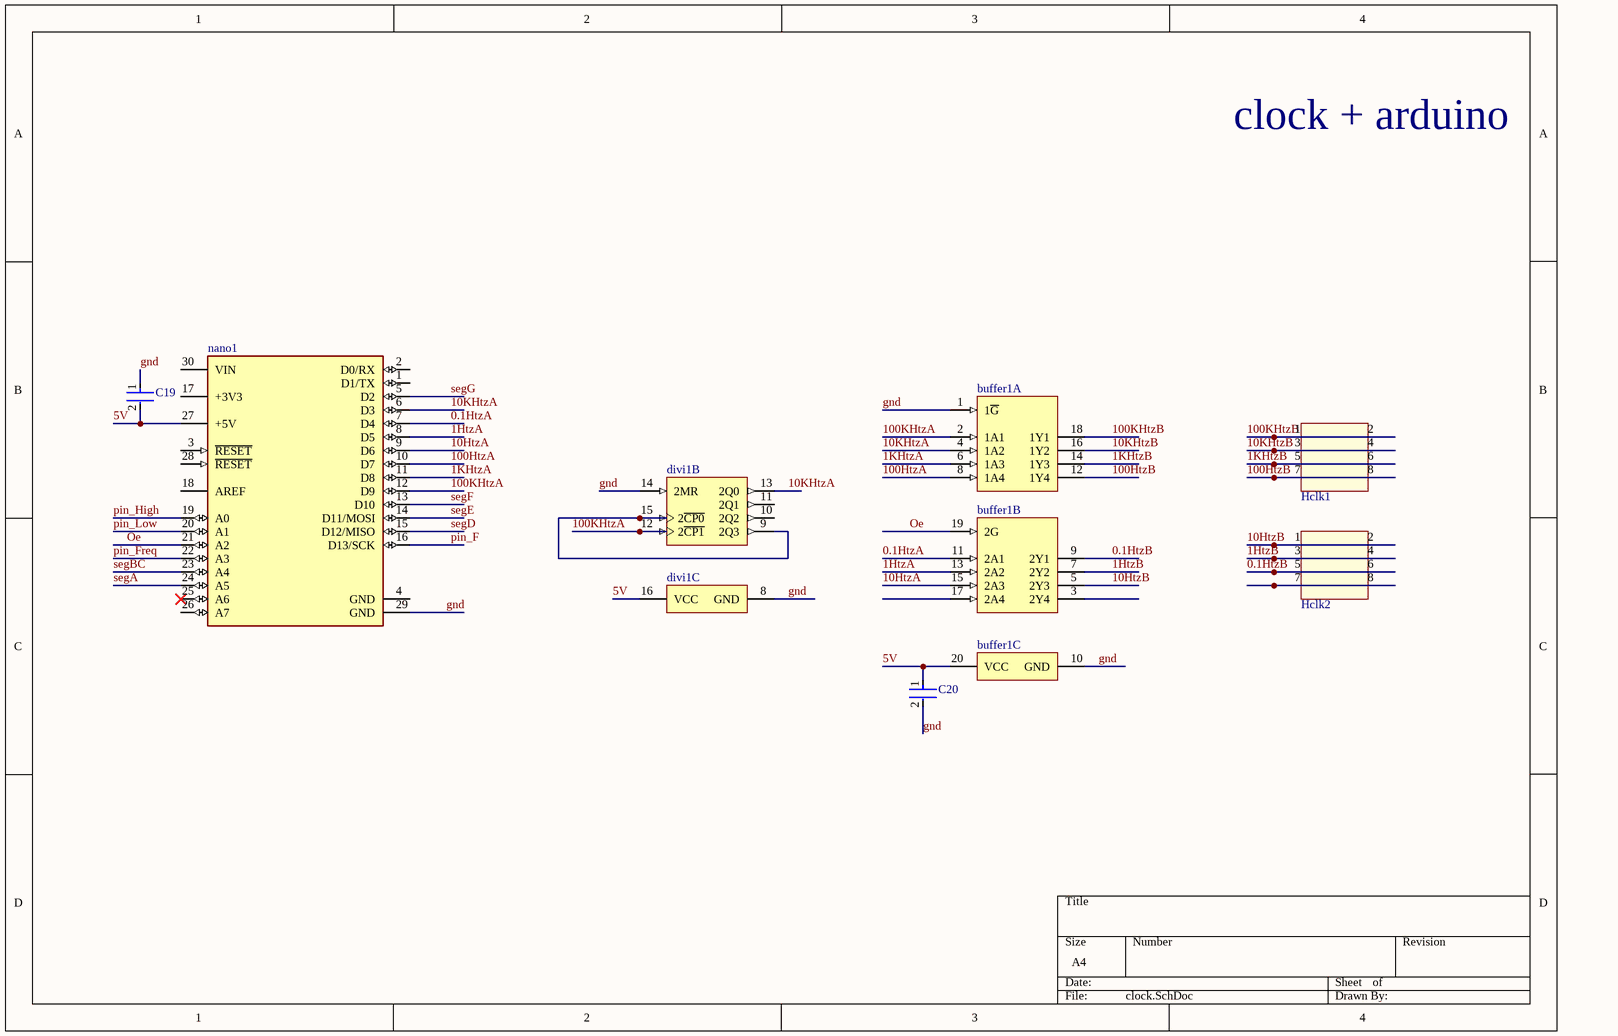
[diagram p3: clock.SchDoc]

### Parts
buffer1  SN74LS241N  [N0020A]  (value not drawn)  (parts A,B,C of 3)
C19  RCER71H335K3K1H03B  [FP-RCE3M1-MFG]  (value not drawn)
C20  RCER71H335K3K1H03B  [FP-RCE3M1-MFG]  (value not drawn)
divi1  CD74HC390E  [N0016A]  (value not drawn)  (parts B,C of 3)
Hclk1  header 2x4  [header 2x4]  (value not drawn)
Hclk2  header 2x4  [header 2x4]  (value not drawn)
nano1  A000005  [FP-A000005-MFG]  (value not drawn)

### Nets
0.1HtzA: buffer1.11(2A1) nano1.7(D4)
0.1HtzB: buffer1.9(2Y1) Hclk2.5 Hclk2.6
1HtzA: buffer1.13(2A2) nano1.8(D5)
1HtzB: buffer1.7(2Y2) Hclk2.3 Hclk2.4
1KHtzA: buffer1.6(1A3) nano1.11(D8)
1KHtzB: buffer1.14(1Y3) Hclk1.5 Hclk1.6
5V: buffer1.20(VCC) C19.2 C20.1 divi1.16(VCC) nano1.27(+5V)
10HtzA: buffer1.15(2A3) nano1.9(D6)
10HtzB: buffer1.5(2Y3) Hclk2.1 Hclk2.2
10KHtzA: buffer1.4(1A2) divi1.13(2Q0) nano1.6(D3)
10KHtzB: buffer1.16(1Y2) Hclk1.3 Hclk1.4
100HtzA: buffer1.8(1A4) nano1.10(D7)
100HtzB: buffer1.12(1Y4) Hclk1.7 Hclk1.8
100KHtzA: buffer1.2(1A1) divi1.12(2~{CP1}) nano1.12(D9)
100KHtzB: buffer1.18(1Y1) Hclk1.1 Hclk1.2
gnd: buffer1.1(1~{G}) buffer1.10(GND) C19.1 C20.2 divi1.8(GND) divi1.14(2MR) nano1.29(GND)
Oe: buffer1.19(2G) nano1.21(A2)
pin_F: nano1.16(D13/SCK)
pin_Freq: nano1.22(A3)
pin_High: nano1.19(A0)
pin_Low: nano1.20(A1)
segA: nano1.24(A5)
segBC: nano1.23(A4)
segD: nano1.15(D12/MISO)
segE: nano1.14(D11/MOSI)
segF: nano1.13(D10)
segG: nano1.5(D2)
Netdivi1_9: divi1.9(2Q3) divi1.15(2~{CP0})
NetHclk2_7: Hclk2.7 Hclk2.8

Not connected (* = marked no-connect by the designer): buffer1 3(2Y4) 17(2A4); divi1 10(2Q2) 11(2Q1); nano1 1(D1/TX) 2(D0/RX) 3(~{RESET}) 4(GND) 17(+3V3) 18(AREF) 25(A6)* 26(A7) 28(~{RESET}) 30(VIN)

### Notes on the sheet
- clock + arduino

### Library data of the parts
buffer1 = CMP-0440-00144-3: Octal Buffers And Line Drivers With 3-State Outputs, N0020A, TUBE; Manufacturer: Texas Instruments; Voltage(Nom)(V): 5; Input Type: TTL; F @ Nom Voltage(Max)(Mhz): 35; tpd @ Nom Voltage(Max)(ns): 18; Bits(#): 8; VCC(Min)(V): 4.75; Rating: Catalog; VCC(Max)(V): 5.25; ICC @ Nom Voltage(Max)(mA): 0.046; Generic Part Number: SN74LS241; Code_JEDEC: MS-001; Operating Temperature Range(C): 0 to 70; PackageVersion: http://www.ti.com/lit/ml/mpdi002c/mpdi002c.pdf; PackageReference: N0020A; Output Type: TTL; DatasheetVersion: SDLS144C
C19 C20 = CMP-06035-028451-1: as C2 on sheet alimentacao; Height: 5mm; Ratings: AEC-Q200; Capacitance: 3.3uF; Package Quantity: 500; Length: 0.217inch; Min Operating Temperature: -55°C; Voltage Rating (DC): 50V; Dielectric: X7R; Case/Package: Radial; Height - Seated (Max): 0.197inch; Termination: Radial; Mount: Through Hole; Max Operating Temperature: 125°C; Width: 0.157inch; Voltage Rating: 50V; Packaging: Bulk; Resistor Type: Ceramic; Tolerance: 10%; Lead Pitch: 0.197inch
divi1 = CMP-1623-00557-2: High Speed CMOS Logic Dual Decade Ripple Counters, N0016A, TUBE; Manufacturer: Texas Instruments; Technology Family: HC; ICC @ Nom Voltage(Max)(mA): 0.08; Inputs: 1; F @ Nom Voltage(Max)(Mhz): 28; tpd @ Nom Voltage(Max)(ns): 52; Bits(#): 4; Input Type: LVTTL/CMOS; Schmitt Trigger: No; Output Drive (IOL/IOH)(Max)(mA): 5.2/-5.2; VCC(Max)(V): 6; Rating: Catalog; VCC(Min)(V): 2; Voltage(Nom)(V): 3.3,5; Output Type: CMOS; Code_JEDEC: MS-001; Generic Part Number: CD74HC390; DatasheetVersion: SCHS185C; Function: Counter; Operating Temperature Range(C): -55 to 125; Type: Decade; PackageReference: N0016A
Hclk1 Hclk2 = header 2x4: header male 2x4; pin to pad: 1>C1 2>C2 3>C3 4>C4 5>C5 6>C6 7>C7 8>C8; Parameter 1: header 2x4
nano1 = CMP-189986-000002-1: ARDUINO NANO ATMEGA328 EVAL BRD; Number of Bits: 8; Evaluation Kit: Yes; Operating Supply Voltage: 12V; Interface: I2C; Data Bus Width: 8b; Core Architecture: AVR; Packaging: Bulk; Length: 7inch; Package Quantity: 50; Width: 5inch; REACH SVHC: No SVHC; Weight: 0.358383oz; Series: AVR® ATmega; Height: 0.25inch

## Nets that join several sheets
5V: alimentacao (12 pins), leds (15 pins), chaves (15 pins), clock (5 pins)
gnd: alimentacao (16 pins), leds (15 pins), chaves (25 pins), clock (7 pins)